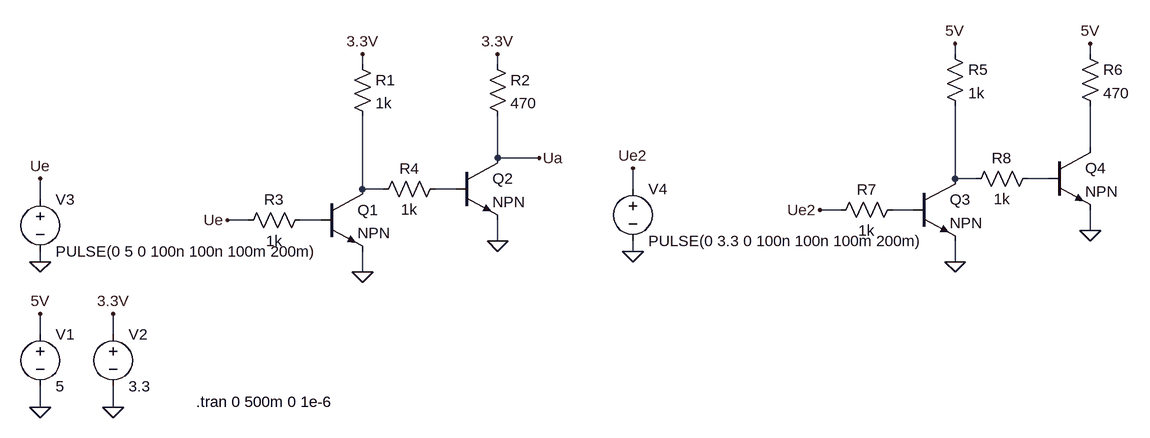
[diagram p0: schematic Levelshifter.asc]
Levelshifter.asc, the LTspice schematic file:
Version 4
SHEET 1 1648 680
WIRE 1376 -272 1376 -288
WIRE 1584 -272 1584 -288
WIRE 464 -256 464 -272
WIRE 672 -256 672 -272
WIRE 1584 -128 1584 -192
WIRE 672 -112 672 -176
WIRE 736 -112 672 -112
WIRE 1376 -80 1376 -192
WIRE 1408 -80 1376 -80
WIRE 1520 -80 1488 -80
WIRE 464 -64 464 -176
WIRE 496 -64 464 -64
WIRE 608 -64 576 -64
WIRE 880 -64 880 -96
WIRE -32 -48 -32 -80
WIRE 1200 -32 1168 -32
WIRE 1312 -32 1280 -32
WIRE 288 -16 256 -16
WIRE 400 -16 368 -16
WIRE 1584 0 1584 -32
WIRE 672 16 672 -16
WIRE 880 32 880 16
WIRE -32 48 -32 32
WIRE 1376 48 1376 16
WIRE 464 64 464 32
WIRE -32 160 -32 128
WIRE 80 160 80 128
WIRE -32 272 -32 240
WIRE 80 272 80 240
FLAG -32 272 0
FLAG 80 272 0
FLAG -32 128 5V
FLAG 80 128 3.3V
FLAG 464 64 0
FLAG 672 16 0
FLAG 672 -272 3.3V
FLAG 464 -272 3.3V
FLAG 256 -16 Ue
FLAG 736 -112 Ua
FLAG -32 48 0
FLAG -32 -80 Ue
FLAG 1376 48 0
FLAG 1584 0 0
FLAG 1168 -32 Ue2
FLAG 880 32 0
FLAG 880 -96 Ue2
FLAG 1376 -288 5V
FLAG 1584 -288 5V
SYMBOL voltage -32 144 R0
WINDOW 123 0 0 Left 0
WINDOW 39 0 0 Left 0
SYMATTR InstName V1
SYMATTR Value 5
SYMBOL voltage 80 144 R0
WINDOW 123 0 0 Left 0
WINDOW 39 0 0 Left 0
SYMATTR InstName V2
SYMATTR Value 3.3
SYMBOL npn 400 -64 R0
SYMATTR InstName Q1
SYMBOL npn 608 -112 R0
SYMATTR InstName Q2
SYMBOL res 448 -272 R0
SYMATTR InstName R1
SYMATTR Value 1k
SYMBOL res 656 -272 R0
SYMATTR InstName R2
SYMATTR Value 470
SYMBOL res 384 -32 R90
WINDOW 0 0 56 VBottom 2
WINDOW 3 32 56 VTop 2
SYMATTR InstName R3
SYMATTR Value 1k
SYMBOL res 592 -80 R90
WINDOW 0 0 56 VBottom 2
WINDOW 3 32 56 VTop 2
SYMATTR InstName R4
SYMATTR Value 1k
SYMBOL voltage -32 -64 R0
WINDOW 123 0 0 Left 0
WINDOW 39 0 0 Left 0
SYMATTR InstName V3
SYMATTR Value PULSE(0 5 0 100n 100n 100m 200m)
SYMBOL npn 1312 -80 R0
SYMATTR InstName Q3
SYMBOL npn 1520 -128 R0
SYMATTR InstName Q4
SYMBOL res 1360 -288 R0
SYMATTR InstName R5
SYMATTR Value 1k
SYMBOL res 1568 -288 R0
SYMATTR InstName R6
SYMATTR Value 470
SYMBOL res 1296 -48 R90
WINDOW 0 0 56 VBottom 2
WINDOW 3 32 56 VTop 2
SYMATTR InstName R7
SYMATTR Value 1k
SYMBOL res 1504 -96 R90
WINDOW 0 0 56 VBottom 2
WINDOW 3 32 56 VTop 2
SYMATTR InstName R8
SYMATTR Value 1k
SYMBOL voltage 880 -80 R0
WINDOW 123 0 0 Left 0
WINDOW 39 0 0 Left 0
SYMATTR InstName V4
SYMATTR Value PULSE(0 3.3 0 100n 100n 100m 200m)
TEXT 208 264 Left 2 !.tran 0 500m 0 1e-6

The netlist it stands for:
* Levelshifter.asc
V1 5V 0 5
V2 3.3V 0 3.3
Q1 N004 N007 0 0 NPN
Q2 Ua N005 0 0 NPN
R1 3.3V N004 1k
R2 3.3V Ua 470
R3 N007 Ue 1k
R4 N005 N004 1k
V3 Ue 0 PULSE(0 5 0 100n 100n 100m 200m)
Q3 N002 N006 0 0 NPN
Q4 N001 N003 0 0 NPN
R5 5V N002 1k
R6 5V N001 470
R7 N006 Ue2 1k
R8 N003 N002 1k
V4 Ue2 0 PULSE(0 3.3 0 100n 100n 100m 200m)
.model NPN NPN
.model PNP PNP
.lib standard.bjt
.tran 0 500m 0 1e-6
.backanno
.end